# Altium project analogtestboard2.PRJPCB
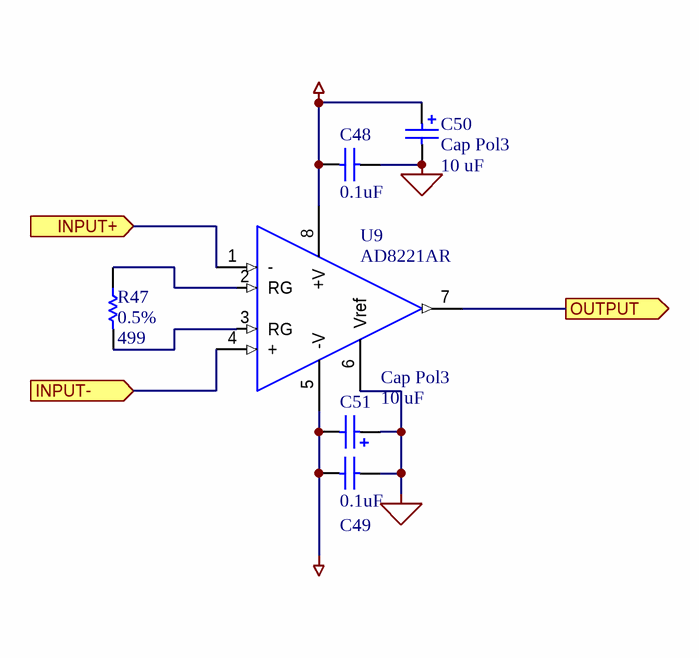
[diagram p0: input.SCHDOC]
3 sheets, 45 parts. Net scope: hierarchical (ports join the sheet entries above them; power ports are global).
Board file: analogtestboard2.PCBDOC
Sheets:
  input.SCHDOC
  PGA.SCHDOC
  AA8513.SCHDOC

## Sheet input.SCHDOC
size B

### Parts
C48  value 0.1uF  [CC1608-0603]  (hidden comment: Cap)
C49  value 0.1uF  [CC1608-0603]  (hidden comment: Cap)
C50  Cap Pol3  value 10 uF  [TC3216-1206]
C51  Cap Pol3  value 10 uF  [TC3216-1206]
R47  0.5%  value 499  [R2012-0805]
U9  AD8221AR  [SO-G8]

### Ports
INPUT+ (in), INPUT- (in), OUTPUT (out)

### Nets
AVDD: C48.1 C50.1 U9.8(+V)
AVSS: C49.1 C51.2 U9.5(-V)
GND: C48.2 C49.2 C50.2 C51.1 U9.6(Vref)
NetR47_1: R47.1 U9.2(RG)
NetR47_2: R47.2 U9.3(RG)
NetU9_1: U9.1(-) ; port INPUT+
NetU9_4: U9.4(+) ; port INPUT-
NetU9_7: U9.7(Vout) ; port OUTPUT

### Library data of the parts
C48 C49 = Cap: Capacitor; Manufacturer: Generic Components; Class I: Passive; Published: 8-Jun-2000; Revision: July-2002: Re-released for DXP Platform.; Publisher: Altium Limited; Class II: Capacitor
C50 C51 = Cap Pol3: Polarized Capacitor (Surface Mount); Manufacturer: Generic Components; Class I: Passive; Published: 8-Jun-2000; Revision: July-2002: Re-released for DXP Platform.; Publisher: Altium Limited; Class II: Capacitor
R47 = Res1: RR1220P-4990-D-M; Manufacturer: Generic Components; Class I: Passive; Class II: Resistor; Published: 8-Jun-2000; Revision: July-2002: Re-released for DXP Platform.; Publisher: Altium Limited
U9 = AD8221: AD8221 Precision Instrumentation Amplifier

## Sheet PGA.SCHDOC
size B
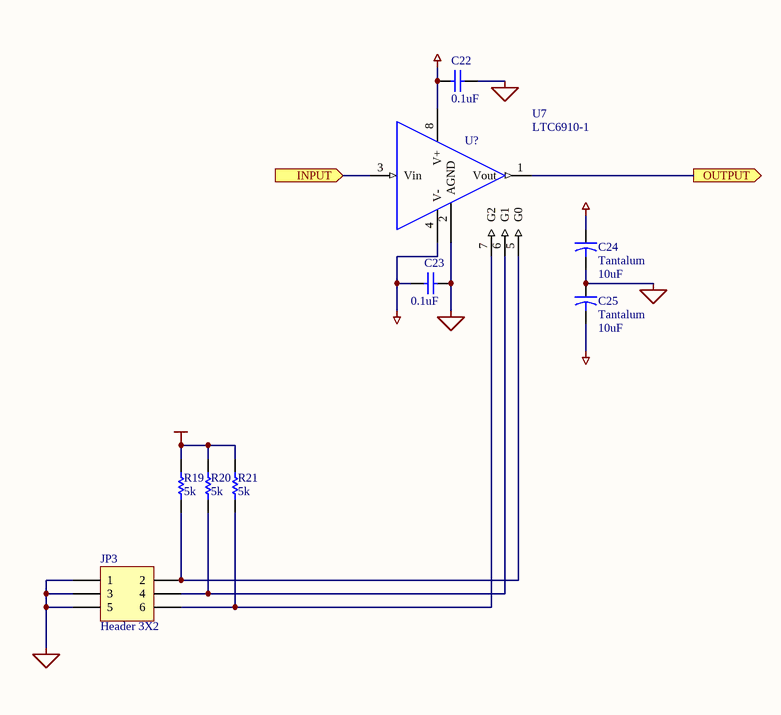
[diagram p1: PGA.SCHDOC]

### Parts
C22  value 0.1uF  [CC1608-0603]  (hidden comment: Cap)
C23  value 0.1uF  [CC1608-0603]  (hidden comment: Cap)
C24  Tantalum  value 10uF  [TC3216-1206]
C25  Tantalum  value 10uF  [TC3216-1206]
JP3  Header 3X2  [HDR2X3]
R19  value 5k  [CC2012-0805]  (hidden comment: Res1)
R20  value 5k  [CC2012-0805]  (hidden comment: Res1)
R21  value 5k  [CC2012-0805]  (hidden comment: Res1)
U7  LTC6910-1  [TSOT-23-8]

### Ports
INPUT (in), OUTPUT (out)

### Nets
AVDD: C22.1 C24.1 R19.2 R20.2 R21.2 U7.8(V+)
AVSS: C23.2 C25.2 U7.4(V-)
GND: C22.2 C23.1 C24.2 C25.1 JP3.1 JP3.3 JP3.5 U7.2(AGND)
NetJP3_2: JP3.2 R19.1 U7.5(G0)
NetJP3_4: JP3.4 R20.1 U7.6(G1)
NetJP3_6: JP3.6 R21.1 U7.7(G2)
NetU7_1: U7.1(Vout) ; port OUTPUT
NetU7_3: U7.3(Vin) ; port INPUT

### Notes on the sheet
- (in symbol LTC6910-2) U?

### Library data of the parts
C22 C23 = Cap: as C48 on sheet input; Published: 8-Jun-2000; Revision: July-2002: Re-released for DXP Platform.; Publisher: Altium Limited; Class II: Capacitor
C24 C25 = Cap2: Capacitor; Manufacturer: Generic Components; Class I: Passive; Published: 23-Sep-2002; Publisher: Altium Limited; Class II: Capacitor
JP3 = Header 3X2: Header, 3-Pin, Dual row; Manufacturer: Generic Components; Class I: Connector; Revision: July-2002: Re-released for DXP Platform.; Publisher: Altium Limited
R19-R21 = Res1: Resistor; Manufacturer: Generic Components; Class I: Passive; Published: 8-Jun-2000; Revision: July-2002: Re-released for DXP Platform.; Publisher: Altium Limited; Class II: Resistor
U7 = LTC6910-2: LTI Digitally Controlled Programmabe Gain Amp

## Sheet AA8513.SCHDOC
size B
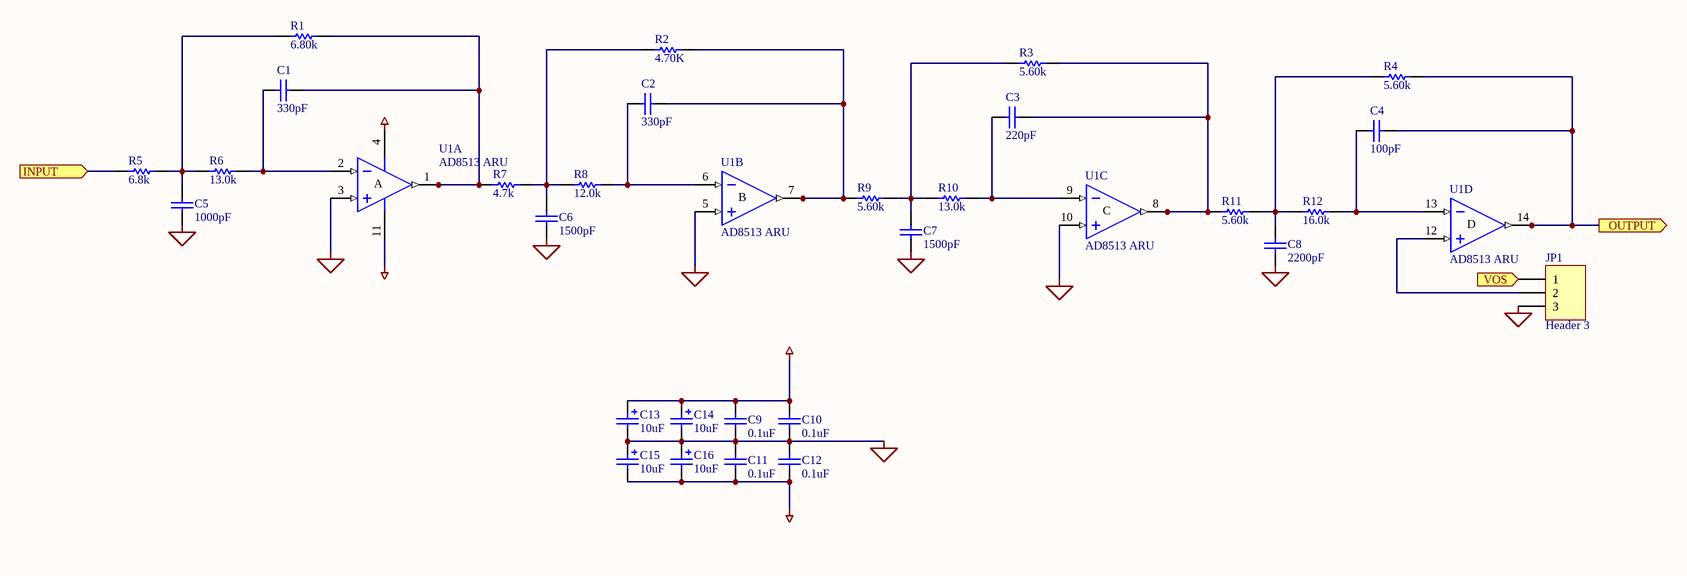
[diagram p2: AA8513.SCHDOC]

### Parts
C1  value 330pF  [CC3216-1206]  (hidden comment: Cap)
C2  value 330pF  [CC3216-1206]  (hidden comment: Cap)
C3  value 220pF  [CC3216-1206]  (hidden comment: Cap)
C4  value 100pF  [CC3216-1206]  (hidden comment: Cap)
C5  value 1000pF  [CC3216-1206]  (hidden comment: Cap)
C6  value 1500pF  [CC3216-1206]  (hidden comment: Cap)
C7  value 1500pF  [CC3216-1206]  (hidden comment: Cap)
C8  value 2200pF  [CC3216-1206]  (hidden comment: Cap)
C9  value 0.1uF  [CC1608-0603]  (hidden comment: Cap)
C10  value 0.1uF  [CC1608-0603]  (hidden comment: Cap)
C11  value 0.1uF  [CC1608-0603]  (hidden comment: Cap)
C12  value 0.1uF  [CC1608-0603]  (hidden comment: Cap)
C13  value 10uF  [TC7360-2924]  (hidden comment: Cap Pol1)
C14  value 10uF  [TC7360-2924]  (hidden comment: Cap Pol1)
C15  value 10uF  [TC7360-2924]  (hidden comment: Cap Pol1)
C16  value 10uF  [TC7360-2924]  (hidden comment: Cap Pol1)
JP1  Header 3  [HDR1X3]
R1  value 6.80k  [CC2012-0805]  (hidden comment: Res1)
R2  value 4.70K  [CC2012-0805]  (hidden comment: Res1)
R3  value 5.60k  [CC2012-0805]  (hidden comment: Res1)
R4  value 5.60k  [CC2012-0805]  (hidden comment: Res1)
R5  value 6.8k  [CC2012-0805]  (hidden comment: Res1)
R6  value 13.0k  [CC2012-0805]  (hidden comment: Res1)
R7  value 4.7k  [CC2012-0805]  (hidden comment: Res1)
R8  value 12.0k  [CC2012-0805]  (hidden comment: Res1)
R9  value 5.60k  [CC2012-0805]  (hidden comment: Res1)
R10  value 13.0k  [CC2012-0805]  (hidden comment: Res1)
R11  value 5.60k  [CC2012-0805]  (hidden comment: Res1)
R12  value 16.0k  [CC2012-0805]  (hidden comment: Res1)
U1  AD8513 ARU  [TSSO5X6-G14/X.3]  (parts A,B,C,D of 4)

### Ports
INPUT (in), OUTPUT (out), VOS (in)

### Nets
AVDD: C9.2 C10.2 C13.1 C14.1 U1.4(V+)
AVSS: C11.1 C12.1 C15.2 C16.2 U1.11(V-)
GND: C5.1 C6.1 C7.1 C8.1 C9.1 C10.1 C11.2 C12.2 C13.2 C14.2 C15.1 C16.1 JP1.3 U1.3(IN+A) U1.5(IN+B) U1.10(IN+C)
NetC1_1: C1.1 R1.1 R7.1 U1.1(OUTA)
NetC1_2: C1.2 R6.2 U1.2(IN-A)
NetC2_1: C2.1 R2.1 R9.1 U1.7(OUTB)
NetC2_2: C2.2 R8.2 U1.6(IN-B)
NetC3_1: C3.1 R3.1 R11.1 U1.8(OUTC)
NetC3_2: C3.2 R10.2 U1.9(IN-C)
NetC4_1: C4.1 R4.1 U1.14(OUTD) ; port OUTPUT
NetC4_2: C4.2 R12.2 U1.13(IN-D)
NetC5_2: C5.2 R1.2 R5.2 R6.1
NetC6_2: C6.2 R2.2 R7.2 R8.1
NetC7_2: C7.2 R3.2 R9.2 R10.1
NetC8_2: C8.2 R4.2 R11.2 R12.1
NetJP1_1: JP1.1 ; port VOS
NetJP1_2: JP1.2 U1.12(IN+D)
NetR5_1: R5.1 ; port INPUT

### Notes on the sheet
- (in symbol AD8513ARU, part A) A
- (in symbol AD8513ARU, part B) B
- (in symbol AD8513ARU, part C) C
- (in symbol AD8513ARU, part D) D

### Library data of the parts
C1-C12 = Cap: as C48 on sheet input; Published: 8-Jun-2000; Revision: July-2002: Re-released for DXP Platform.; Publisher: Altium Limited; Class II: Capacitor
C13-C16 = Cap Pol1: Polarized Capacitor (Radial); Manufacturer: Generic Components; Class I: Passive; Published: 8-Jun-2000; Revision: July-2002: Re-released for DXP Platform.; Publisher: Altium Limited; Class II: Capacitor
JP1 = Header 3: Header, 3-Pin; Manufacturer: Generic Components; Class I: Connector; Revision: July-2002: Re-released for DXP Platform.; Publisher: Altium Limited
R1-R12 = Res1: as R19 on sheet PGA; Published: 8-Jun-2000; Revision: July-2002: Re-released for DXP Platform.; Publisher: Altium Limited; Class II: Resistor
U1 = AD8513ARU: low-noise JFET quad OA

## Nets that join several sheets
AVDD: input (C48.1 C50.1 U9.8), PGA (6 pins), AA8513 (5 pins)
AVSS: input (C49.1 C51.2 U9.5), PGA (C23.2 C25.2 U7.4), AA8513 (5 pins)
GND: input (5 pins), PGA (8 pins), AA8513 (16 pins)